# Altium schematic sheet modFOC-Motion_Controller.SchDoc: modFOC-Motion_Controller
size A4; Date: dssd; DocumentNumber: 1; Revision: 1; SheetNumber: 1; SheetTotal: 3
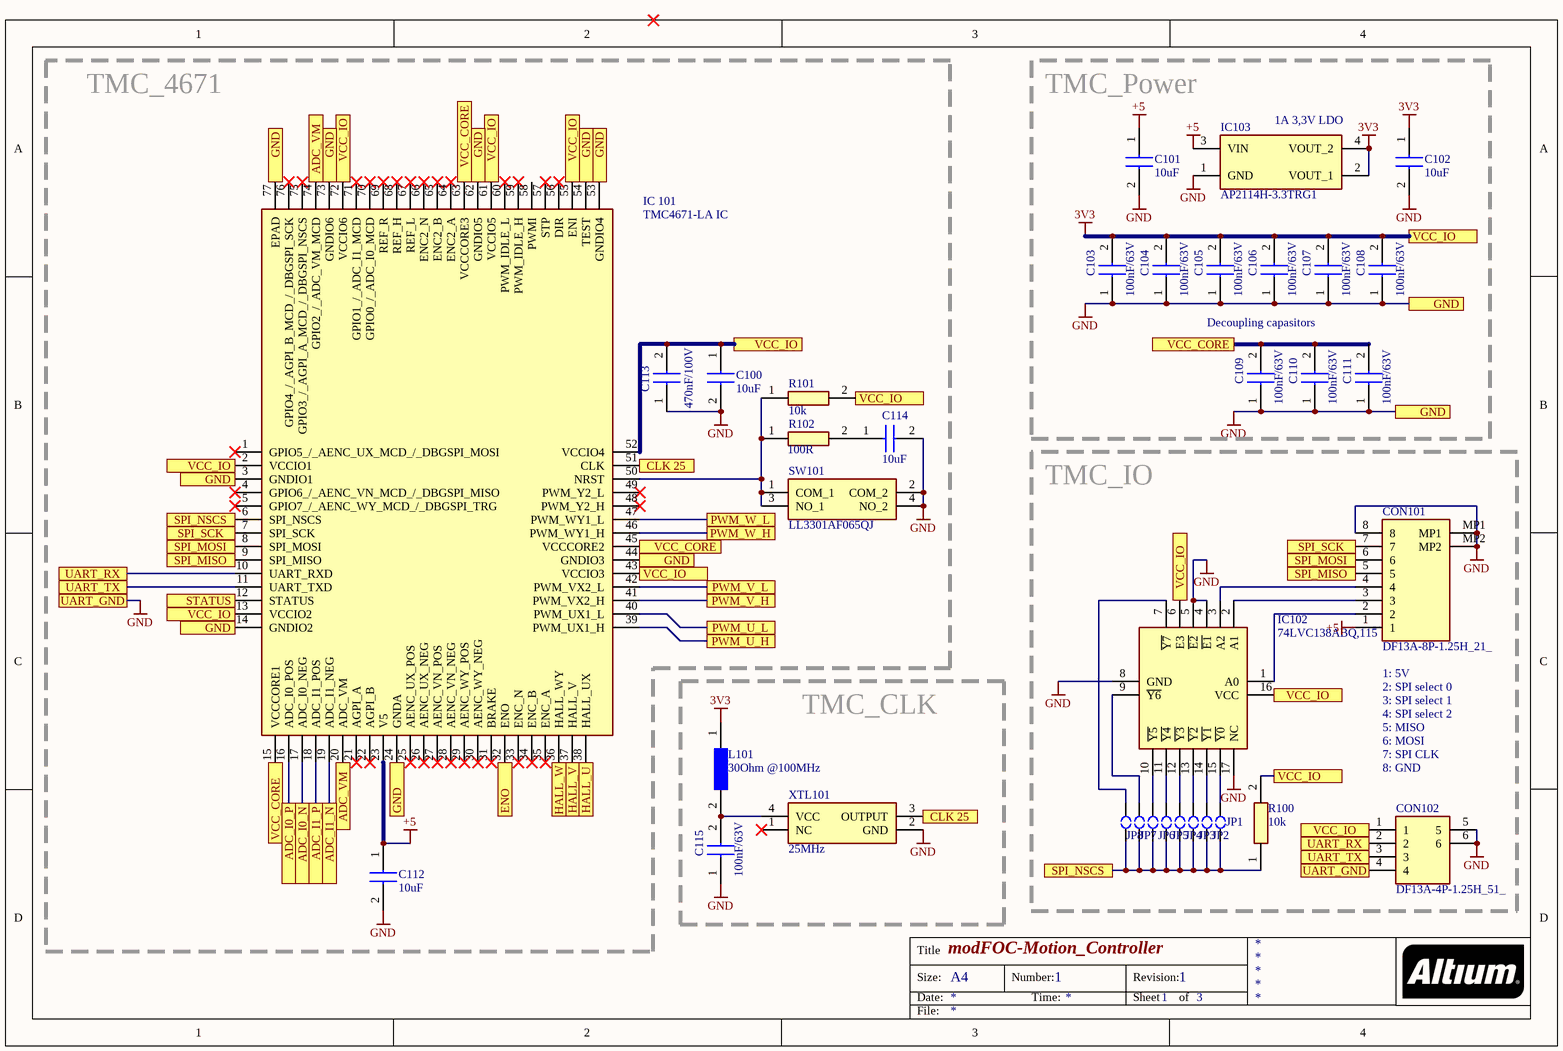
[diagram p0: modFOC-Motion_Controller.SchDoc]

## Parts
C100  10uF  [CAPC3225X280N]
C101  10uF  [CAPC3225X280N]
C102  10uF  [CAPC3225X280N]
C103  100nF/63V  [CAPC1608X97N]
C104  100nF/63V  [CAPC1608X97N]
C105  100nF/63V  [CAPC1608X97N]
C106  100nF/63V  [CAPC1608X97N]
C107  100nF/63V  [CAPC1608X97N]
C108  100nF/63V  [CAPC1608X97N]
C109  100nF/63V  [CAPC1608X97N]
C110  100nF/63V  [CAPC1608X97N]
C111  100nF/63V  [CAPC1608X97N]
C112  10uF  [CAPC3225X280N]
C113  470nF/100V  [CAPC2012X140N]
C114  10uF  [CAPC3225X280N]
C115  100nF/63V  [CAPC1608X97N]
CON101  DF13A-8P-1.25H_21_  [DF13A8P125H21]
CON102  DF13A-4P-1.25H_51_  [DF13A4P125H51]
IC102  74LVC138ABQ,115  [74HCT595BQ115]
IC103  AP2114H-3.3TRG1  [SOT230P700X180-4N]
IC_101  TMC4671-LA IC  [QFN40P1050X650X90-77N]
JP1  SolderJumper  [SolderJmp_0.8mm]  (value not drawn)
JP2  SolderJumper  [SolderJmp_0.8mm]  (value not drawn)
JP3  SolderJumper  [SolderJmp_0.8mm]  (value not drawn)
JP4  SolderJumper  [SolderJmp_0.8mm]  (value not drawn)
JP5  SolderJumper  [SolderJmp_0.8mm]  (value not drawn)
JP6  SolderJumper  [SolderJmp_0.8mm]  (value not drawn)
JP7  SolderJumper  [SolderJmp_0.8mm]  (value not drawn)
JP8  SolderJumper  [SolderJmp_0.8mm]  (value not drawn)
L101  30Ohm @100MHz  [BLM18KG101TH1D]
R100  10k  [RESC1608X55N]
R101  10k  [RESC1608X55N]
R102  100R  [RESC1608X55N]
SW101  LL3301AF065QJ  [LL3301FF065QJ]
XTL101  25MHz  [FOX924B25]

## Blocks framed on the sheet
TMC_4671: C100 C112-C114 IC_101 R101 R102 SW101
TMC_Power: C101-C111 IC103
TMC_IO: CON101 CON102 IC102 JP1-JP8 R100
TMC_CLK: C115 L101 XTL101

## Ports
ADC_I0_N, ADC_I0_P, ADC_I1_N, ADC_I1_P, ADC_VM, CLK 25, ENO, GND, HALL_U, HALL_V, HALL_W, PWM_U_H, PWM_U_L, PWM_V_H, PWM_V_L, PWM_W_H, PWM_W_L, SPI_MISO, SPI_MOSI, SPI_NSCS, SPI_SCK, STATUS, UART_GND, UART_RX, UART_TX, VCC_CORE, VCC_IO

## Nets
3V3: C100.1 C102.1 C103.2 C104.2 C105.2 C106.2 C107.2 C108.2 C113.2 CON102.1 IC102.6(E3) IC102.16(VCC) IC103.2(VOUT_1) IC103.4(VOUT_2) IC_101.2(VCCIO1) IC_101.13(VCCIO2) IC_101.43(VCCIO3) IC_101.52(VCCIO4) IC_101.55(ENI) IC_101.61(VCCIO5) IC_101.72(VCCIO6) L101.1 R100.2 R101.2 ; port VCC_IO
+5: C101.1 C112.1 CON101.1 IC103.3(VIN) IC_101.23(V5)
GND: C100.2 C101.2 C102.2 C103.1 C104.1 C105.1 C106.1 C107.1 C108.1 C109.1 C110.1 C111.1 C112.2 C113.1 C114.2 C115.1 CON101.8 CON101.MP1 CON101.MP2 CON102.4 CON102.5 CON102.6 IC102.4(~{E1}) IC102.5(~{E2}) IC102.8(GND) IC102.17(NC) IC103.1(GND) IC_101.3(GNDIO1) IC_101.14(GNDIO2) IC_101.24(GNDA) IC_101.44(GNDIO3) IC_101.53(GNDIO4) IC_101.54(TEST) IC_101.62(GNDIO5) IC_101.73(GNDIO6) IC_101.77(EPAD) SW101.2(COM_2) SW101.4(NO_2) XTL101.2(GND) ; port GND, port UART_GND
ADC_I0_N: IC_101.17(ADC_I0_NEG) ; port ADC_I0_N
ADC_I0_P: IC_101.16(ADC_I0_POS) ; port ADC_I0_P
ADC_I1_N: IC_101.19(ADC_I1_NEG) ; port ADC_I1_N
ADC_I1_P: IC_101.18(ADC_I1_POS) ; port ADC_I1_P
ADC_VM: IC_101.20(ADC_VM) IC_101.74(GPIO2_/_ADC_VM_MCD) ; port ADC_VM
CLK 25: IC_101.51(CLK) XTL101.3(OUTPUT) ; port CLK 25
ENO: IC_101.32(ENO) ; port ENO
HALL_U: IC_101.38(HALL_UX) ; port HALL_U
HALL_V: IC_101.37(HALL_V) ; port HALL_V
HALL_W: IC_101.36(HALL_WY) ; port HALL_W
PWM_U_H: IC_101.39(PWM_UX1_H) ; port PWM_U_H
PWM_U_L: IC_101.40(PWM_UX1_L) ; port PWM_U_L
PWM_V_H: IC_101.41(PWM_VX2_H) ; port PWM_V_H
PWM_V_L: IC_101.42(PWM_VX2_L) ; port PWM_V_L
PWM_W_H: IC_101.46(PWM_WY1_H) ; port PWM_W_H
PWM_W_L: IC_101.47(PWM_WY1_L) ; port PWM_W_L
SPI_MISO: CON101.5 IC_101.9(SPI_MISO) ; port SPI_MISO
SPI_MOSI: CON101.6 IC_101.8(SPI_MOSI) ; port SPI_MOSI
SPI_NSCS: IC_101.6(SPI_NSCS) JP1.1 JP2.1 JP3.1 JP4.1 JP5.1 JP6.1 JP7.1 JP8.1 R100.1 ; port SPI_NSCS
SPI_SCK: CON101.7 IC_101.7(SPI_SCK) ; port SPI_SCK
STATUS: IC_101.12(STATUS) ; port STATUS
UART_RX: CON102.2 IC_101.10(UART_RXD) ; port UART_RX
UART_TX: CON102.3 IC_101.11(UART_TXD) ; port UART_TX
VCC_CORE: C109.2 C110.2 C111.2 IC_101.15(VCCCORE1) IC_101.45(VCCCORE2) IC_101.63(VCCCORE3) ; port VCC_CORE
NetC114_1: C114.1 R102.2
NetC115_2: C115.2 L101.2 XTL101.4(VCC)
NetCON101_2: CON101.2 IC102.1(A0)
NetCON101_3: CON101.3 IC102.2(A1)
NetCON101_4: CON101.4 IC102.3(A2)
NetIC102_7: IC102.7(~{Y7}) JP8.2
NetIC102_9: IC102.9(~{Y6}) JP7.2
NetIC102_10: IC102.10(~{Y5}) JP6.2
NetIC102_11: IC102.11(~{Y4}) JP5.2
NetIC102_12: IC102.12(~{Y3}) JP4.2
NetIC102_13: IC102.13(~{Y2}) JP3.2
NetIC102_14: IC102.14(~{Y1}) JP2.2
NetIC102_15: IC102.15(~{Y0}) JP1.2
NetIC_101_50: IC_101.50(NRST) R101.1 R102.1 SW101.1(COM_1) SW101.3(NO_1)

Not connected (* = marked no-connect by the designer): IC_101 1(GPIO5_/_AENC_UX_MCD_/_DBGSPI_MOSI)* 4(GPIO6_/_AENC_VN_MCD_/_DBGSPI_MISO)* 5(GPIO7_/_AENC_WY_MCD_/_DBGSPI_TRG)* 21(AGPI_A)* 22(AGPI_B)* 25(AENC_UX_POS)* 26(AENC_UX_NEG)* 27(AENC_VN_POS)* 28(AENC_VN_NEG)* 29(AENC_WY_POS)* 30(AENC_WY_NEG)* 31(BRAKE)* 33(ENC_N)* 34(ENC_B)* 35(ENC_A)* 48(PWM_Y2_H)* 49(PWM_Y2_L)* 56(DIR)* 57(STP)* 58(PWMI) 59(PWM_IDLE_H)* 60(PWM_IDLE_L)* 64(ENC2_A)* 65(ENC2_B)* 66(ENC2_N)* 67(REF_L)* 68(REF_H)* 69(REF_R)* 70(GPIO0_/_ADC_I0_MCD)* 71(GPIO1_/_ADC_I1_MCD)* 75(GPIO3_/_AGPI_A_MCD_/_DBGSPI_NSCS)* 76(GPIO4_/_AGPI_B_MCD_/_DBGSPI_SCK)*; XTL101 1(NC)*

## Notes on the sheet
- (near IC103) 1A 3,3V LDO
- Decoupling capasitors
- (near CON101) 1: 5V
- 2: SPI select 0
- 3: SPI select 1
- 4: SPI select 2
- 5: MISO
- 6: MOSI
- 7: SPI CLK
- 8: GND
- Title
- Size:
- Date:
- A4
- Number:
- Time:
- Revision:
- Sheet
- of
- File:

## Library data of the parts
C100-C102 C112 C114 = CL32B106KMVNNWE: Capacitor; Manufacturer_Name: Samsung Electro-Mechanics; Datasheet Link: https://www.arrow.com/en/products/cl32b106kmvnnwe/samsung-electro-mechanics; Height: 2.8mm; Manufacturer_Part_Number: CL32B106KMVNNWE; Arrow Part Number: CL32B106KMVNNWE; Arrow Price/Stock: https://www.arrow.com/en/products/cl32b106kmvnnwe/samsung-electro-mechanics; Mouser Part Number: 187-CL32B106KMVNNWE; Mouser Price/Stock: https://www.mouser.co.uk/ProductDetail/Samsung-Electro-Mechanics/CL32B106KMVNNWE?qs=xZ%2FP%252Ba9zWqaEMBbSgKy8gQ%3D%3D
C103-C111 C115 = C0805C104MMREC7210: Capacitor; Manufacturer_Name: Vishay; Manufacturer_Part_Number: VJ0603Y104JXJAC; Datasheet Link: http://www.vishay.com/docs/45226/vj31xrohsautomlcc.pdf; Height: 1mm; Mouser Part Number: 77-VJ0603Y104JXJAC; Mouser Price/Stock: https://www.mouser.com/Search/Refine.aspx?Keyword=77-VJ0603Y104JXJAC
C113 = 08051C474KAT2A: Capacitor; Manufacturer_Name: AVX; Datasheet Link: http://datasheets.avx.com/X7RDielectric.pdf; Height: 1.4mm; Manufacturer_Part_Number: 08051C474KAT2A; Mouser Part Number: 581-08051C474KAT2A; Mouser Price/Stock: https://www.mouser.co.uk/ProductDetail/AVX/08051C474KAT2A?qs=%2FjdEcI0p95Mz%2FN5KbrGN6Q%3D%3D
CON101 = DF13A-8P-1.25H_21_: Connector; Manufacturer_Name: Hirose; Manufacturer_Part_Number: DF13A-8P-1.25H(21); Datasheet Link: http://uk.rs-online.com/web/p/products/7793617P; Height: 3.6mm; Mouser Part Number: 798-DF13A8P125H21; Mouser Price/Stock: https://www.mouser.co.uk/ProductDetail/Hirose-Connector/DF13A-8P-125H21?qs=XQjbzJWzFPViW0MGk5%2FVbA%3D%3D
CON102 = DF13A-4P-1.25H_51_: Connector; Manufacturer_Name: Hirose; Manufacturer_Part_Number: DF13A-4P-1.25H(51); Datasheet Link: https://www.hirose.com/product/en/products/DF13/DF13A-4P-1.25H%2851%29/; Height: 3mm; Mouser Part Number: 798-DF13A4P125H51; Mouser Price/Stock: https://www.mouser.co.uk/ProductDetail/Hirose-Connector/DF13A-4P-125H51?qs=XQjbzJWzFPVR%252B%2FH2vthd9w%3D%3D
IC102 = 74LVC138ABQ,115: Integrated Circuit; Manufacturer_Name: Nexperia; Datasheet Link: https://assets.nexperia.com/documents/data-sheet/74LVC138A.pdf; Manufacturer_Part_Number: 74LVC138ABQ,115; Arrow Part Number: 74LVC138ABQ,115; Arrow Price/Stock: https://www.arrow.com/en/products/74lvc138abq115/nexperia; Mouser Part Number: 771-LVC138ABQ115; Mouser Price/Stock: https://www.mouser.co.uk/ProductDetail/Nexperia/74LVC138ABQ115?qs=me8TqzrmIYUqHGpwzmLq4w%3D%3D
IC103 = AP2114H-3.3TRG1: Integrated Circuit; Manufacturer_Name: Diodes Inc.; Datasheet Link: http://uk.rs-online.com/web/p/products/8283528; Height: 1.8mm; Manufacturer_Part_Number: AP2114H-3.3TRG1; Arrow Part Number: AP2114H-3.3TRG1; Arrow Price/Stock: https://www.arrow.com/en/products/ap2114h-3.3trg1/diodes-incorporated; Mouser Part Number: 621-AP2114H-3.3TRG1; Mouser Price/Stock: https://www.mouser.co.uk/ProductDetail/Diodes-Incorporated/AP2114H-33TRG1?qs=x6A8l6qLYDDSG%2FfwzcsOhw%3D%3D
IC_101 = TMC4671-LA IC: Integrated Circuit
L101 = BLM18KG300TH1D: Ferrite Bead; Manufacturer_Name: Murata Electronics; Datasheet Link: https://www.murata.com/en-us/products/productdetail?partno=BLM18KG300TH1%23; Height: 0.75mm; Manufacturer_Part_Number: BLM18KG300TH1D; Arrow Part Number: BLM18KG300TH1D; Arrow Price/Stock: https://www.arrow.com/en/products/blm18kg300th1d/murata-manufacturing; Mouser Part Number: 81-BLM18KG300TH1D; Mouser Price/Stock: https://www.mouser.com/Search/Refine.aspx?Keyword=81-BLM18KG300TH1D
R100 R101 = RC0603FR-0710KL: Resistor; Manufacturer_Name: YAGEO (PHYCOMP); Datasheet Link: http://www.yageo.com/documents/recent/PYu-RC0603_51_RoHS_L_v5.pdf; Height: 0.55mm; Manufacturer_Part_Number: RC0603FR-0710KL; Arrow Part Number: RC0603FR-0710KL; Arrow Price/Stock: https://www.arrow.com/en/products/rc0603fr-0710kl/yageo; Mouser Part Number: 603-RC0603FR-0710KL; Mouser Price/Stock: https://www.mouser.co.uk/ProductDetail/Yageo/RC0603FR-0710KL?qs=grNVn54RoB%252B3GtjbJj3wJQ%3D%3D
R102 = CRCW0603100RFKEAC: Resistor; Manufacturer_Name: Vishay; Datasheet Link: https://componentsearchengine.com/Datasheets/1/CRCW0603100RFKEAC.pdf; Height: 0.55mm; Manufacturer_Part_Number: CRCW0603100RFKEAC; Mouser Part Number: 71-CRCW0603100RFKEAC; Mouser Price/Stock: https://www.mouser.co.uk/ProductDetail/Vishay-Dale/CRCW0603100RFKEAC/?qs=E3Y5ESvWgWPJqb4%2F19sAKw%3D%3D; Arrow Part Number: CRCW0603100RFKEAC; Arrow Price/Stock: https://www.arrow.com/en/products/crcw0603100rfkeac/vishay
SW101 = LL3301AF065QJ: Switch; Manufacturer_Name: E-Switch; Datasheet Link: https://media.digikey.com/pdf/Data%20Sheets/E-Switch%20PDFs/LL3301AF065QJ.pdf; Height: 7.3mm; Manufacturer_Part_Number: LL3301AF065QJ; Mouser Part Number: 612-LL3301AF065QJ; Mouser Price/Stock: https://www.mouser.co.uk/ProductDetail/E-Switch/LL3301AF065QJ?qs=QtyuwXswaQi68RkbBY57jQ%3D%3D
XTL101 = FOX924B-25: 25Mhz Oscillator